# EAGLE design mde_v1 (EAGLE 9.6.2)
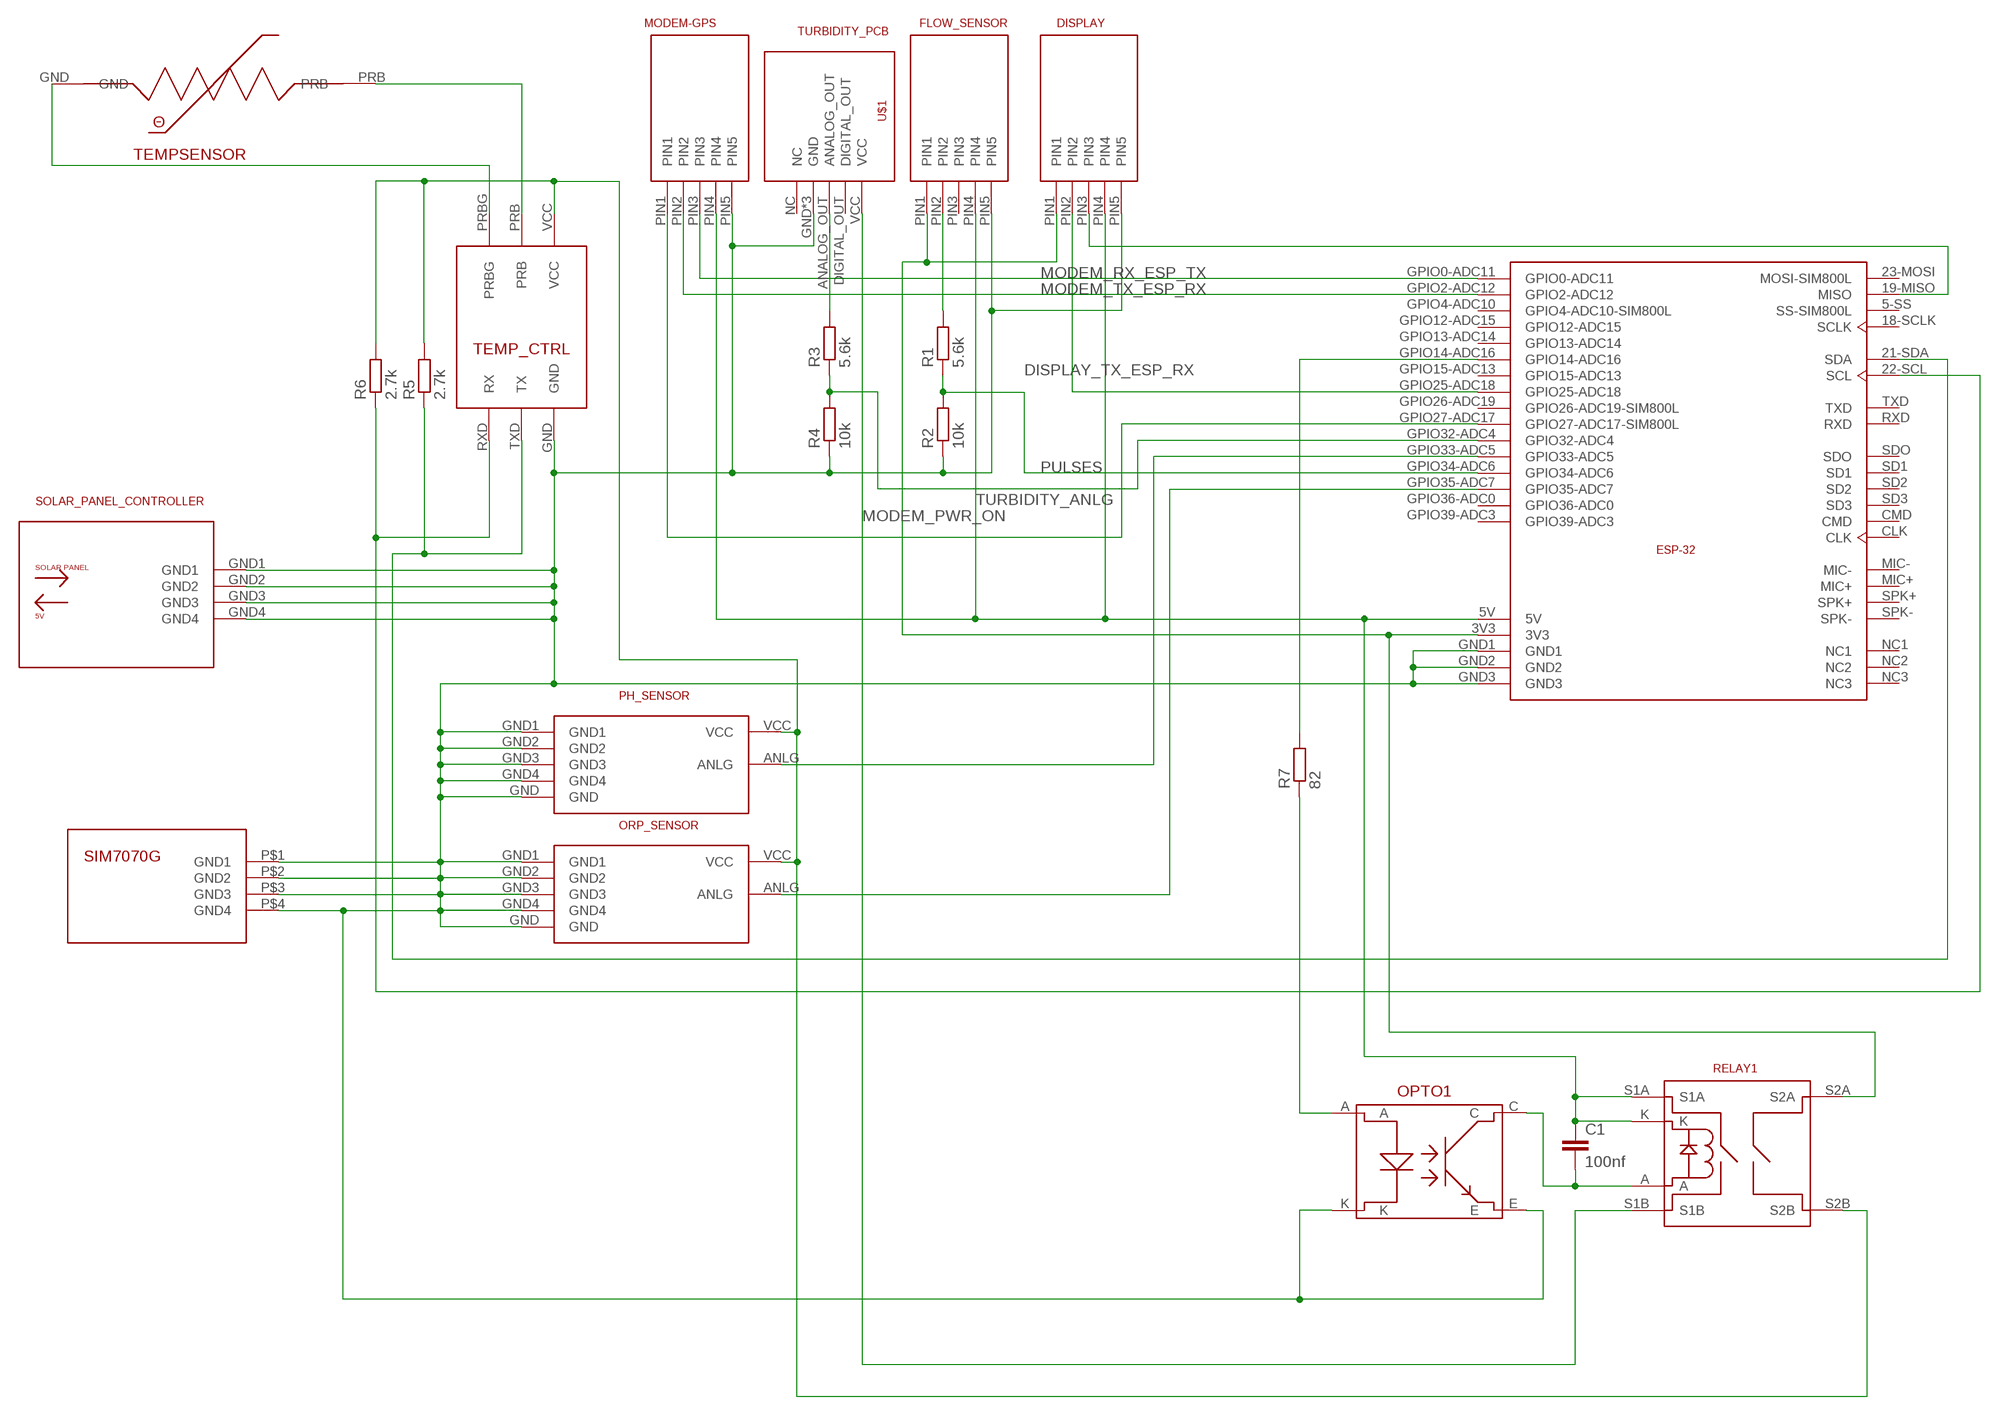
[diagram p0: schematic, sheet 1]

## Parts
C1  100nf  C2,5-3  [C2.5-3]
DISPLAY  CONNECTOR-JSTXH-5  [CONNECTOR-JSTXH-5]
ESP-32  ESP32-TTGO-SIM800L  [ESP32-TTGO-SIM800L]
FLOW_SENSOR  CONNECTOR-JSTXH-5  [CONNECTOR-JSTXH-5]
MODEM-GPS  CONNECTOR-JSTXH-5  [CONNECTOR-JSTXH-5]
OPTO1  K817P  [K817P]
ORP_SENSOR  GRAVITY-PCB  [GRAVITY-PCB]
PH_SENSOR  GRAVITY-PCB  [GRAVITY-PCB]
R1  5.6k  R-EU_0207/10  [0207/10]
R2  10k  R-EU_0207/10  [0207/10]
R3  5.6k  R-EU_0207/10  [0207/10]
R4  10k  R-EU_0207/10  [0207/10]
R5  2.7k  R-EU_0207/10  [0207/10]
R6  2.7k  R-EU_0207/10  [0207/10]
R7  82  R-EU_0207/10  [0207/10]
RELAY1  DIP05-2A72-21D  [DIP05-2A72-21D]
SIM7070G  SIM7070G  [SIM7070G]
SOLAR_PANEL_CONTROLLER  DFR0559  [DFR0559]
TEMP_CTRL  EZO-RTD  [EZO-RTD]
TEMPSENSOR  TEMP-PROBE  [TEMP-PROBE]
U$1  TURBIDITY_PCB  [TURBIDITY_PCB]

## Nets
3V3 [power]: DISPLAY.PIN1 ESP-32.3V3 FLOW_SENSOR.PIN1 RELAY1.S2A
3V3_SENSORS [power]: ORP_SENSOR.VCC PH_SENSOR.VCC R5.2 R6.2 RELAY1.S2B TEMP_CTRL.VCC
5V [power]: C1.1 DISPLAY.PIN4 ESP-32.5V FLOW_SENSOR.PIN4 MODEM-GPS.PIN4 RELAY1.K RELAY1.S1A
5V_SENSOR [power]: RELAY1.S1B U$1.VCC
DISPLAY_RX_ESP_TX: DISPLAY.PIN3 ESP-32.19-MISO(MISO)
DISPLAY_TX_ESP_RX [signals]: DISPLAY.PIN2 ESP-32.GPIO25-ADC18
GND: DISPLAY.PIN5 ESP-32.GND1 ESP-32.GND2 ESP-32.GND3 FLOW_SENSOR.PIN5 MODEM-GPS.PIN5 OPTO1.E OPTO1.K ORP_SENSOR.GND ORP_SENSOR.GND1 ORP_SENSOR.GND2 ORP_SENSOR.GND3 ORP_SENSOR.GND4 PH_SENSOR.GND PH_SENSOR.GND1 PH_SENSOR.GND2 PH_SENSOR.GND3 PH_SENSOR.GND4 R2.1 R4.1 SIM7070G.P$1(GND1) SIM7070G.P$2(GND2) SIM7070G.P$3(GND3) SIM7070G.P$4(GND4) SOLAR_PANEL_CONTROLLER.GND1 SOLAR_PANEL_CONTROLLER.GND2 SOLAR_PANEL_CONTROLLER.GND3 SOLAR_PANEL_CONTROLLER.GND4 TEMP_CTRL.GND U$1.GND U$1.P$1(GND) U$1.P$2(GND)
MODEM_PWR_ON: ESP-32.GPIO27-ADC17(GPIO27-ADC17-SIM800L) MODEM-GPS.PIN1
MODEM_RX_ESP_TX [signals]: ESP-32.GPIO0-ADC11 MODEM-GPS.PIN3
MODEM_TX_ESP_RX [signals]: ESP-32.GPIO2-ADC12 MODEM-GPS.PIN2
N$1 [signals]: TEMP_CTRL.PRBG TEMPSENSOR.GND
N$2 [signals]: TEMP_CTRL.PRB TEMPSENSOR.PRB
N$4: ESP-32.GPIO14-ADC16 R7.2
N$5 [signals]: R3.2 U$1.ANALOG_OUT
N$6 [signals]: FLOW_SENSOR.PIN2 R1.2
N$7 [signals]: ESP-32.GPIO35-ADC7 ORP_SENSOR.ANLG
N$8 [signals]: ESP-32.GPIO33-ADC5 PH_SENSOR.ANLG
N$17: OPTO1.A R7.1
N$19: C1.2 OPTO1.C RELAY1.A
PULSES [signals]: ESP-32.GPIO34-ADC6 R1.1 R2.2
SCL: ESP-32.22-SCL(SCL) R6.1 TEMP_CTRL.RXD(RX)
SDA: ESP-32.21-SDA(SDA) R5.1 TEMP_CTRL.TXD(TX)
TURBIDITY_ANLG [signals]: ESP-32.GPIO32-ADC4 R3.1 R4.2
Unconnected: ESP-32.5-SS(SS-SIM800L) ESP-32.18-SCLK(SCLK) ESP-32.23-MOSI(MOSI-SIM800L) ESP-32.CLK ESP-32.CMD ESP-32.GPIO4-ADC10(GPIO4-ADC10-SIM800L) ESP-32.GPIO12-ADC15 ESP-32.GPIO13-ADC14 ESP-32.GPIO15-ADC13 ESP-32.GPIO26-ADC19(GPIO26-ADC19-SIM800L) ESP-32.GPIO36-ADC0 ESP-32.GPIO39-ADC3 ESP-32.MIC+ ESP-32.MIC- ESP-32.NC1 ESP-32.NC2 ESP-32.NC3 ESP-32.RXD ESP-32.SD1 ESP-32.SD2 ESP-32.SD3 ESP-32.SDO ESP-32.SPK+ ESP-32.SPK- ESP-32.TXD FLOW_SENSOR.PIN3 U$1.DIGITAL_OUT U$1.NC

## Library data of the parts
C1 = capacitor-wima:C: CAPACITOR naming: grid - package width
DISPLAY FLOW_SENSOR MODEM-GPS = chris_mde:CONNECTOR-JSTXH-5
ESP-32 = chris_mde:ESP32-TTGO-SIM800L
OPTO1 = chris_mde:K817P
ORP_SENSOR PH_SENSOR = chris_mde:GRAVITY-PCB
R1-R7 = rcl:R-EU_: RESISTOR, European symbol; SPICEPREFIX: R
RELAY1 = chris_mde:DIP05-2A72-21D
SIM7070G = chris_mde:SIM7070G
SOLAR_PANEL_CONTROLLER = chris_mde:DFR0559
TEMP_CTRL = chris_mde:EZO-RTD
TEMPSENSOR = chris_mde:TEMP-PROBE
U$1 = chris_mde:TURBIDITY_PCB

## Net classes
0 default: width 0.406 mm, clearance 0.406 mm
1 power: width 0.813 mm, clearance 0.813 mm
2 signals: width 0.406 mm, clearance 0.406 mm

## Board
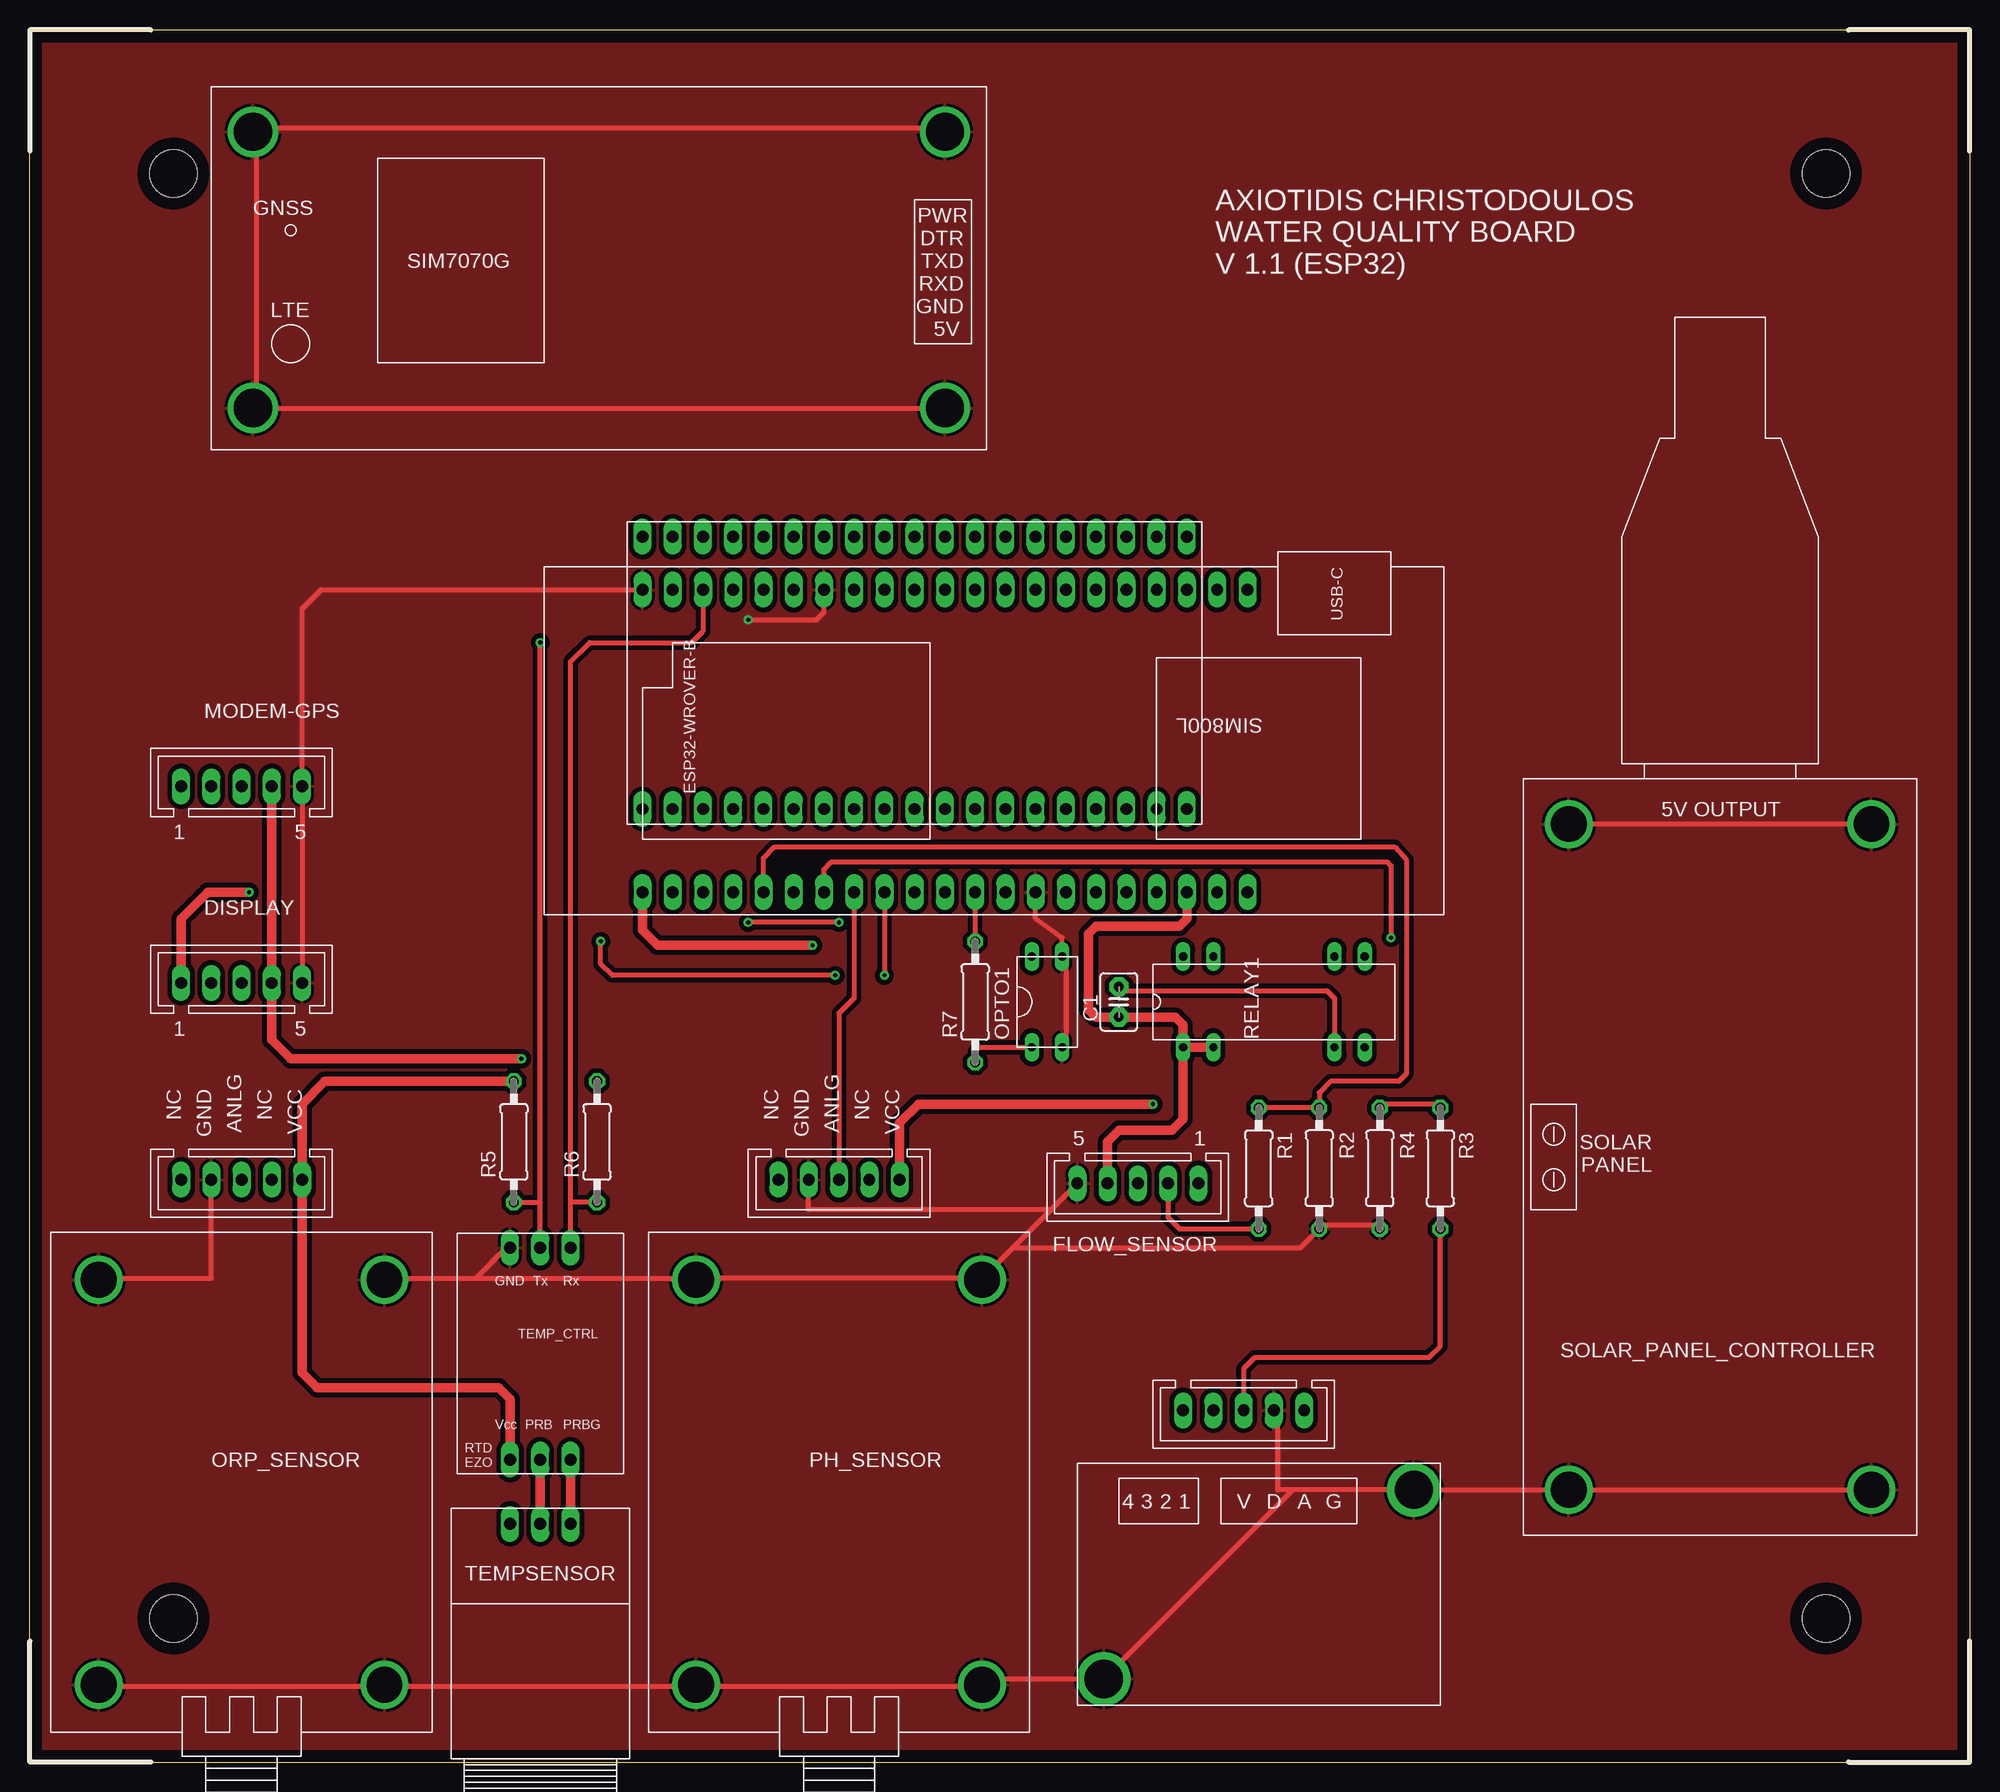
[diagram p1: board, top side]
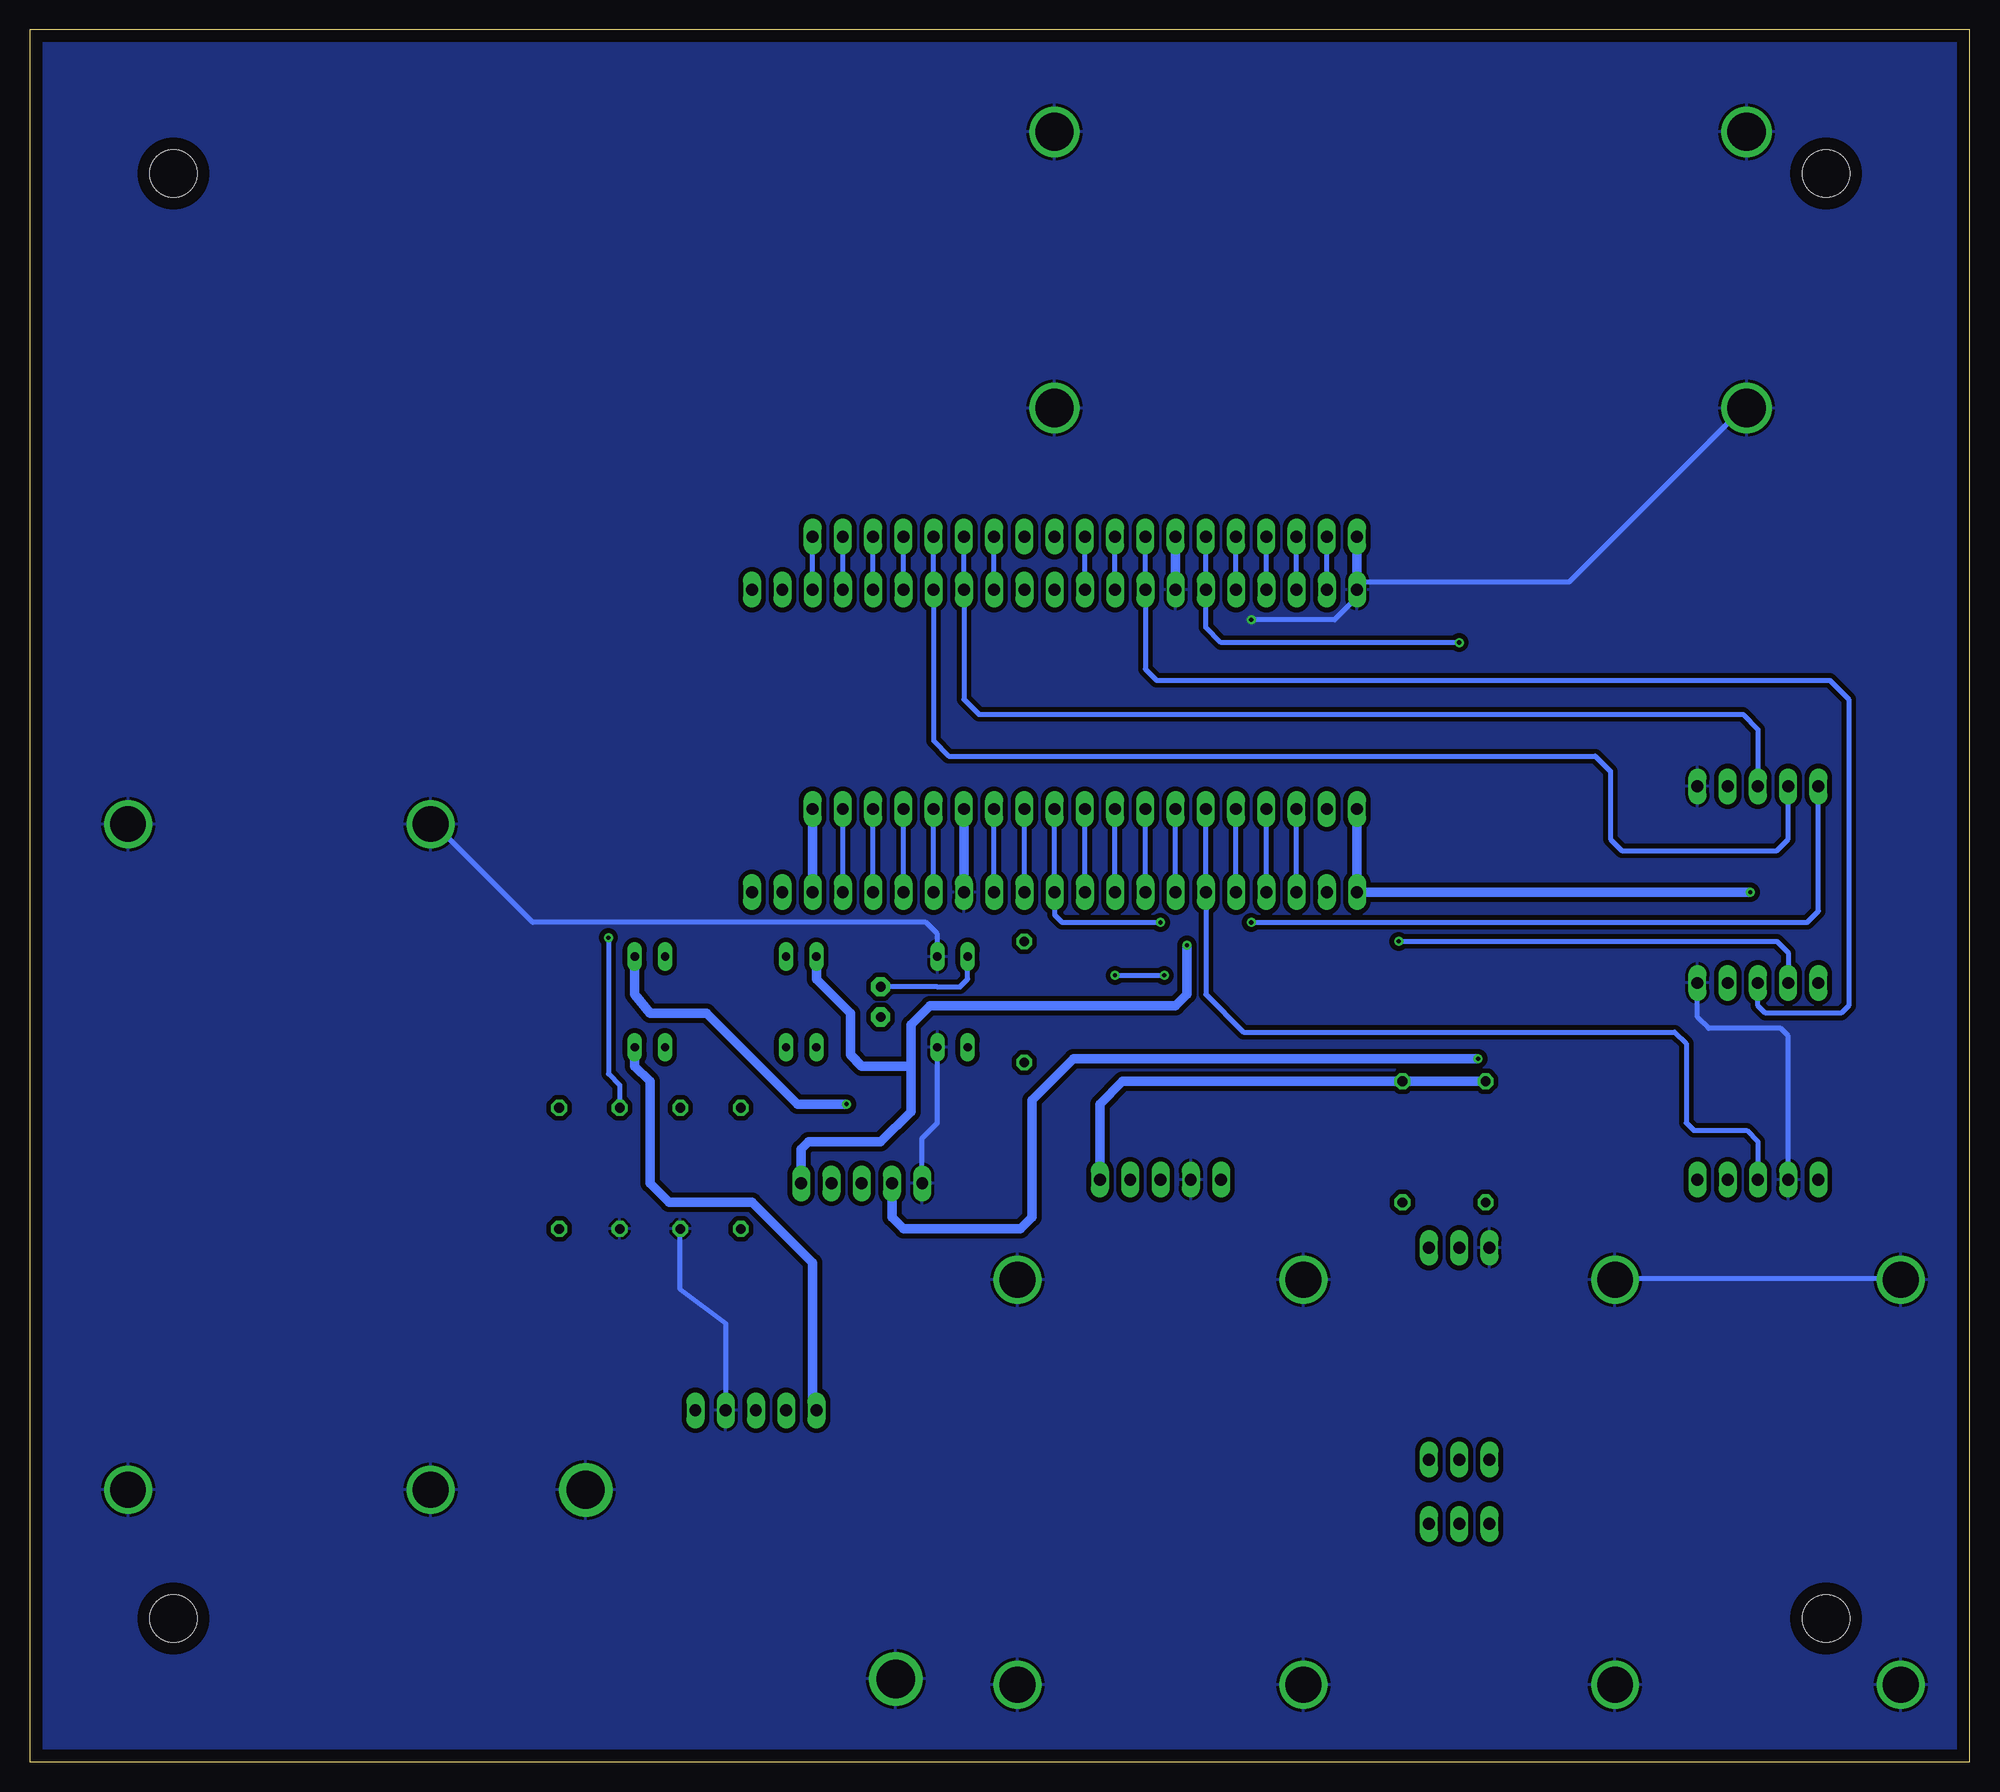
[diagram p2: board, bottom side, seen from below]

Size 162.88 x 145.41 mm. Coordinates in mm from the lower left corner, seen from the top.
Outline: 0,0 162.88,0 162.88,145.41 0,145.41 0,0
Copper layers (1*16): Top 0.035mm / dielectric 1.5mm / Bottom 0.035mm
Design rules "default": minimum track width 6mil, minimum drill 0.35mm, track to track 6mil, track to pad 6mil, pad to pad 6mil, via to via 6mil, smd to smd 6mil, copper to edge 40mil, drill to drill 6mil, minimum pad ring 10mil, minimum via ring 8mil, stop-mask expansion 4mil, vias tented up to drill 0mil, thermal gap 10mil
Holes 4 mm at 12.06,133.35 150.81,133.35 150.81,12.06 12.06,12.06

### Footprints (pad centres in the part's own frame; a part is rotated, then mirrored left to right if it is on the bottom)
C2.5-3 = drill 0.813 pad 1.6 octagon: 1 -1.27,0; 2 1.27,0
CONNECTOR-JSTXH-5 = drill 1 long: PIN1 -5.08,0; PIN2 -2.54,0; PIN3 0,0; PIN4 2.54,0; PIN5 5.08,0
ESP32-TTGO-SIM800L = drill 1 long: 3V3 -12.7,25.4; 5-SS 12.7,2.54; 5V -12.7,-20.32; 18-SCLK 12.7,5.08; 19-MISO 12.7,7.62; 21-SDA 12.7,12.7; 22-SCL 12.7,20.32; 23-MOSI 12.7,22.86; CLK 12.7,-20.32; CMD -12.7,-17.78; GND1 12.7,10.16; GND2 12.7,25.4; GND3 -12.7,-7.62; GPIO0-ADC11 12.7,-7.62; GPIO2-ADC12 12.7,-10.16; GPIO4-ADC10 12.7,-5.08; GPIO12-ADC15 -12.7,-5.08; GPIO13-ADC14 -12.7,-10.16; GPIO14-ADC16 -12.7,-2.54; GPIO15-ADC13 12.7,-12.7; GPIO25-ADC18 -12.7,5.08; GPIO26-ADC19 -12.7,2.54; GPIO27-ADC17 -12.7,0; GPIO32-ADC4 -12.7,10.16; GPIO33-ADC5 -12.7,7.62; GPIO34-ADC6 -12.7,15.24; GPIO35-ADC7 -12.7,12.7; GPIO36-ADC0 -12.7,20.32; GPIO39-ADC3 -12.7,17.78; MIC+ 12.7,-25.4; MIC- 12.7,-22.86; NC1 12.7,-2.54; NC2 12.7,0; NC3 -12.7,22.86; P$1 -5.715,25.4; P$2 -5.715,22.86; P$3 -5.715,20.32; P$4 -5.715,17.78; P$5 -5.715,15.24; P$6 -5.715,12.7; P$7 -5.715,10.16; P$8 -5.715,7.62; P$9 -5.715,5.08; P$10 -5.715,2.54; P$11 -5.715,0; P$12 -5.715,-2.54; P$13 -5.715,-5.08; P$14 -5.715,-7.62; P$15 -5.715,-10.16; P$16 -5.715,-12.7; P$17 -5.715,-15.24; P$18 -5.715,-17.78; P$19 -5.715,-20.32; P$20 17.145,25.4; P$21 17.145,22.86; P$22 17.145,20.32; P$23 17.145,17.78; P$24 17.145,15.24; P$25 17.145,12.7; P$26 17.145,10.16; P$27 17.145,7.62; P$28 17.145,5.08; P$29 17.145,2.54; P$30 17.145,0; P$31 17.145,-2.54; P$32 17.145,-5.08; P$33 17.145,-7.62; P$34 17.145,-10.16; P$35 17.145,-12.7; P$36 17.145,-15.24; P$37 17.145,-17.78; P$38 17.145,-20.32; RXD 12.7,15.24; SD1 12.7,-15.24; SD2 -12.7,-12.7; SD3 -12.7,-15.24; SDO 12.7,-17.78; SPK+ -12.7,-22.86; SPK- -12.7,-25.4; TXD 12.7,17.78
K817P = drill 0.7 long: A -3.81,1.27; C 3.81,1.27; E 3.81,-1.27; K -3.81,-1.27
GRAVITY-PCB = drill 1 long: ANLG 0,25.4; GND -2.54,25.4; NC 2.54,25.4; NC2 -5.08,25.4; VCC 5.08,25.4 | drill 3: GND1 -12,17; GND2 12,17; GND3 -12,-17; GND4 12,-17
0207/10 = drill 0.813 octagon: 1 -5.08,0; 2 5.08,0
DIP05-2A72-21D = drill 0.7 long: A -3.81,-5.08; K -3.81,5.08; NC1 3.81,5.08; NC2 3.81,-5.08; S1A -3.81,7.62; S1B -3.81,-7.62; S2A 3.81,7.62; S2B 3.81,-7.62
SIM7070G = drill 3.2: P$1 0,0; P$2 58.102,0; P$3 0,23.177; P$4 58.102,23.177
DFR0559 = drill 3: GND1 -12.7,27.94; GND2 12.7,27.94; GND3 -12.7,-27.94; GND4 12.7,-27.94
EZO-RTD = drill 1 long: GND -2.54,8.89; PRB 0,-8.89; PRBG 2.54,-8.89; RXD 2.54,8.89; TXD 0,8.89; VCC -2.54,-8.89
TEMP-PROBE = drill 1 long: GND 2.54,0; NC -2.54,0; PRB 0,0
TURBIDITY_PCB = drill 1 long: ANALOG_OUT -2.54,-19.05; DIGITAL_OUT 0,-19.05; GND -5.08,-19.05; NC -7.62,-19.05; VCC 2.54,-19.05 | drill 3.2 pad 4.5: P$1 -16.828,-12.383; P$2 9.207,3.493

### Placement (x,y rotation side)
C1  91.44,63.82 90 top
DISPLAY  17.78,65.41 0 top
ESP-32  76.83,85.72 90 top
FLOW_SENSOR  93.03,48.58 180 top
MODEM-GPS  17.78,81.92 0 top
OPTO1  85.41,63.82 90 top
ORP_SENSOR  17.78,23.5 0 top
PH_SENSOR  67.94,23.5 0 top
R1  103.19,49.85 270 top
R2  108.27,49.85 90 top
R3  118.43,49.85 270 top
R4  113.35,49.85 90 top
R5  40.64,52.07 90 top
R6  47.62,52.07 90 top
R7  79.38,63.82 90 top
RELAY1  104.46,63.82 90 top
SIM7070G  76.83,136.84 180 top
SOLAR_PANEL_CONTROLLER  141.92,50.8 180 top
TEMP_CTRL  42.86,34.29 0 top
TEMPSENSOR  42.86,20 0 top
U$1  99.38,10.48 180 top

### Tracks (layer width: path | path; a pad name or v marks a point on that pad's centre or on a via)
3V3  (via drill 0.35)
  Top 0.813: DISPLAY.PIN1 12.7,70.8 14.92,73.03 v18.41,73.03 | ESP-32.3V3 51.44,69.85 52.7,68.58 v65.72,68.58
  Bottom 0.813: ESP-32.3V3 v18.41,73.03 | v65.72,68.58 65.72,64.45 66.67,63.5 87.31,63.5 88.9,61.91 88.9,58.42 | FLOW_SENSOR.PIN1 98.11,51.44 97.47,52.07 91.44,52.07 88.9,54.61 88.9,58.42 | RELAY1.S2A 96.84,65.72 93.98,62.87 93.98,59.37 93.03,58.42 88.9,58.42
3V3_SENSORS  (via drill 0.35)
  Top 0.813: R5.2 24.77,57.15 22.86,55.24 ORP_SENSOR.VCC 22.86,32.7 24.13,31.43 39.37,31.43 40.32,30.48 TEMP_CTRL.VCC | v94.3,55.24 74.61,55.24 73.03,53.66 PH_SENSOR.VCC
  Bottom 0.813: R5.2 R6.2 71.12,57.15 73.03,55.24 PH_SENSOR.VCC | v94.3,55.24 98.42,55.24 106.05,62.87 110.81,62.87 112.08,64.45 RELAY1.S2B
5V  (via drill 0.35)
  Top 0.813: MODEM-GPS.PIN4 DISPLAY.PIN4 20.32,60.64 21.91,59.05 v41.27,59.05 | ESP-32.5V 97.16,70.8 96.52,70.17 89.53,70.17 88.9,69.53 88.9,63.18 89.53,62.55 C1.1 96.2,62.55 96.84,61.91 RELAY1.S1A | RELAY1.S1A RELAY1.K | FLOW_SENSOR.PIN4 90.49,52.07 91.44,53.02 95.89,53.02 96.84,53.98 RELAY1.S1A
  Bottom 0.813: FLOW_SENSOR.PIN4 90.49,45.72 89.53,44.77 79.69,44.77 78.74,45.72 78.74,55.56 75.25,59.05 v41.27,59.05
5V_SENSOR
  Bottom 0.813: RELAY1.S1B 112.08,58.42 110.81,57.15 110.81,48.58 109.22,46.99 102.23,46.99 97.16,41.91 97.16,29.84 U$1.VCC
DISPLAY_RX_ESP_TX
  Bottom 0.406: DISPLAY.PIN3 17.78,63.5 17.14,62.87 10.79,62.87 10.16,63.5 10.16,89.22 11.75,90.81 68.26,90.81 69.22,91.76 ESP-32.19-MISO
DISPLAY_TX_ESP_RX  (via drill 0.35)
  Top 0.406: v47.94,68.9 47.94,66.99 48.9,66.04 v67.63,66.04 | ESP-32.GPIO25-ADC18 v71.75,66.04
  Bottom 0.406: DISPLAY.PIN2 15.24,67.94 16.19,68.9 v47.94,68.9 | v71.75,66.04 v67.63,66.04
GND  (via drill 0.35)
  Top 0.406: SIM7070G.P$1 76.83,137.16 19.05,137.16 SIM7070G.P$2 19.05,136.53 19.05,113.67 | ESP-32.GND1 66.67,96.52 66.04,95.89 v60.33,95.89 | 19.05,113.67 SIM7070G.P$3 | 19.05,113.67 SIM7070G.P$4 | ORP_SENSOR.GND3 6.35,6.35 29.21,6.35 ORP_SENSOR.GND4 29.84,6.35 55.88,6.35 PH_SENSOR.GND3 56.52,6.35 79.38,6.35 PH_SENSOR.GND4 80.01,6.99 U$1.P$2 106.05,22.86 | DISPLAY.PIN5 MODEM-GPS.PIN5 22.86,96.84 24.45,98.42 ESP-32.GND2 | ORP_SENSOR.GND 15.24,40.64 6.35,40.64 ORP_SENSOR.GND1 | 106.05,22.86 U$1.P$1 SOLAR_PANEL_CONTROLLER.GND2 SOLAR_PANEL_CONTROLLER.GND1 | 106.05,22.86 104.78,22.86 104.78,29.21 U$1.GND | 37.47,40.64 40.01,43.18 TEMP_CTRL.GND | 37.47,40.64 29.84,40.64 ORP_SENSOR.GND2 | 37.47,40.64 55.88,40.64 PH_SENSOR.GND1 56.52,40.64 79.38,40.64 PH_SENSOR.GND2 80.01,40.64 82.55,43.18 | SOLAR_PANEL_CONTROLLER.GND3 SOLAR_PANEL_CONTROLLER.GND4 | OPTO1.K 87,60.33 87,67.31 OPTO1.E 86.68,69.22 84.45,70.8 ESP-32.GND3 | R4.1 113.03,45.09 108.58,45.09 R2.1 106.68,43.18 82.55,43.18 | 82.55,43.18 85.72,46.35 | 85.72,46.35 FLOW_SENSOR.PIN5 | PH_SENSOR.GND 65.41,46.35 85.72,46.35
  Bottom 0.406: SIM7070G.P$4 19.05,113.67 33.66,99.06 51.44,99.06 ESP-32.GND2 51.44,97.79 53.34,95.89 v60.33,95.89 | OPTO1.E 86.68,69.53 87.63,70.48 120.65,70.48 128.91,78.74 SOLAR_PANEL_CONTROLLER.GND4 | U$1.GND 104.46,36.83 108.27,39.69 R2.1 | ORP_SENSOR.GND1 6.35,40.64 29.21,40.64 ORP_SENSOR.GND2 | DISPLAY.PIN5 22.86,62.55 21.91,61.59 15.88,61.59 15.24,60.96 ORP_SENSOR.GND | OPTO1.K 86.68,53.66 87.95,52.39 FLOW_SENSOR.PIN5
  pour Top: 162.88,0 162.88,145.41 0,145.41 0,0
  pour Bottom: 162.88,0 162.88,145.41 0,145.41 0,0
MODEM_PWR_ON  (via drill 0.35)
  Top 0.406: v67.94,70.48 v60.33,70.48
  Bottom 0.406: MODEM-GPS.PIN1 12.7,71.44 13.65,70.48 v60.33,70.48 | v67.94,70.48 76.2,70.48 76.83,71.12 ESP-32.GPIO27-ADC17
MODEM_RX_ESP_TX
  Bottom 0.406: MODEM-GPS.PIN3 17.78,86.68 19.05,87.95 83.19,87.95 84.45,89.22 ESP-32.GPIO0-ADC11
MODEM_TX_ESP_RX
  Bottom 0.406: MODEM-GPS.PIN2 15.24,77.47 16.19,76.52 29.21,76.52 30.16,77.47 30.16,83.19 31.43,84.45 85.72,84.45 87,85.72 ESP-32.GPIO2-ADC12
N$1
  Top 0.813: TEMP_CTRL.PRBG TEMPSENSOR.GND
N$2
  Top 0.813: TEMP_CTRL.PRB TEMPSENSOR.PRB
N$4
  Top 0.406: ESP-32.GPIO14-ADC16 R7.2
N$5
  Top 0.406: R3.2 118.43,34.92 117.47,33.97 102.87,33.97 101.92,33.02 U$1.ANALOG_OUT
N$6
  Top 0.406: R1.2 96.52,44.77 95.57,45.72 FLOW_SENSOR.PIN2
N$7
  Bottom 0.406: ESP-32.GPIO35-ADC7 64.14,64.45 60.96,61.28 24.77,61.28 23.81,60.33 23.81,53.66 23.18,53.02 18.73,53.02 17.78,52.07 ORP_SENSOR.ANLG
N$8
  Top 0.406: PH_SENSOR.ANLG 67.94,62.87 69.22,64.14 ESP-32.GPIO33-ADC5
N$17
  Top 0.406: OPTO1.A 79.69,60.01 79.38,59.69 R7.1
N$19
  Top 0.406: RELAY1.A 109.54,64.14 108.9,64.77 91.44,64.77 C1.2
  Bottom 0.406: OPTO1.C 84.14,65.72 84.77,65.09 86.68,65.09 C1.2
PULSES
  Top 0.406: R1.1 R2.2 108.27,56.2 109.22,57.15 114.94,57.15 115.57,57.78 115.57,75.75 114.61,76.83 62.54,76.83 61.59,75.88 ESP-32.GPIO34-ADC6
SCL
  Top 0.406: ESP-32.22-SCL 56.52,94.93 55.56,93.98 46.99,93.98 45.4,92.39 45.4,46.99 | TEMP_CTRL.RXD 45.4,46.99 | R6.1 45.4,46.99
SDA  (via drill 0.35)
  Top 0.406: TEMP_CTRL.TXD 42.86,46.99 | 42.86,46.99 v42.86,93.98 | R5.1 42.86,46.99
  Bottom 0.406: ESP-32.21-SDA 64.14,95.25 62.87,93.98 v42.86,93.98
TURBIDITY_ANLG  (via drill 0.35)
  Top 0.406: R4.2 113.67,55.24 118.11,55.24 R3.1 | v114.3,69.22 114.3,75.25 113.98,75.56 67.31,75.56 66.67,74.93 ESP-32.GPIO32-ADC4
  Bottom 0.406: v114.3,69.22 114.3,57.78 113.35,56.83 R4.2

### Text on the board
tPlace: AXIOTIDIS CHRISTODOULOS / WATER QUALITY BOARD / V 1.1 (ESP32)